# Altium project Phaser.PrjPCB (part 2 of 5)

## Sheet PWR_Supply.SchDoc: Phaser
size 420 x 297 mm; EDA_Number: ARTIQ; Projet: ARTIQ/SINARA; Author: G.Kasprowicz; CompanyName: WUT ISE; DrawnBy: G.Kasprowicz; Organization: WUT ISE; Address1: PW ISE; Address2: Nowowiejska 15/19 00-665 Warsaw; Address3: gkasprow@gmail.com; Revision: 2; SheetNumber: -; SheetTotal: -; ModifiedBy: -; CheckedDate: -; Title2: xxx; DivGrp: WUT ISE; Designer: G.Kasprowicz; ModifiedDate: -; ProjectName: Sensor Box
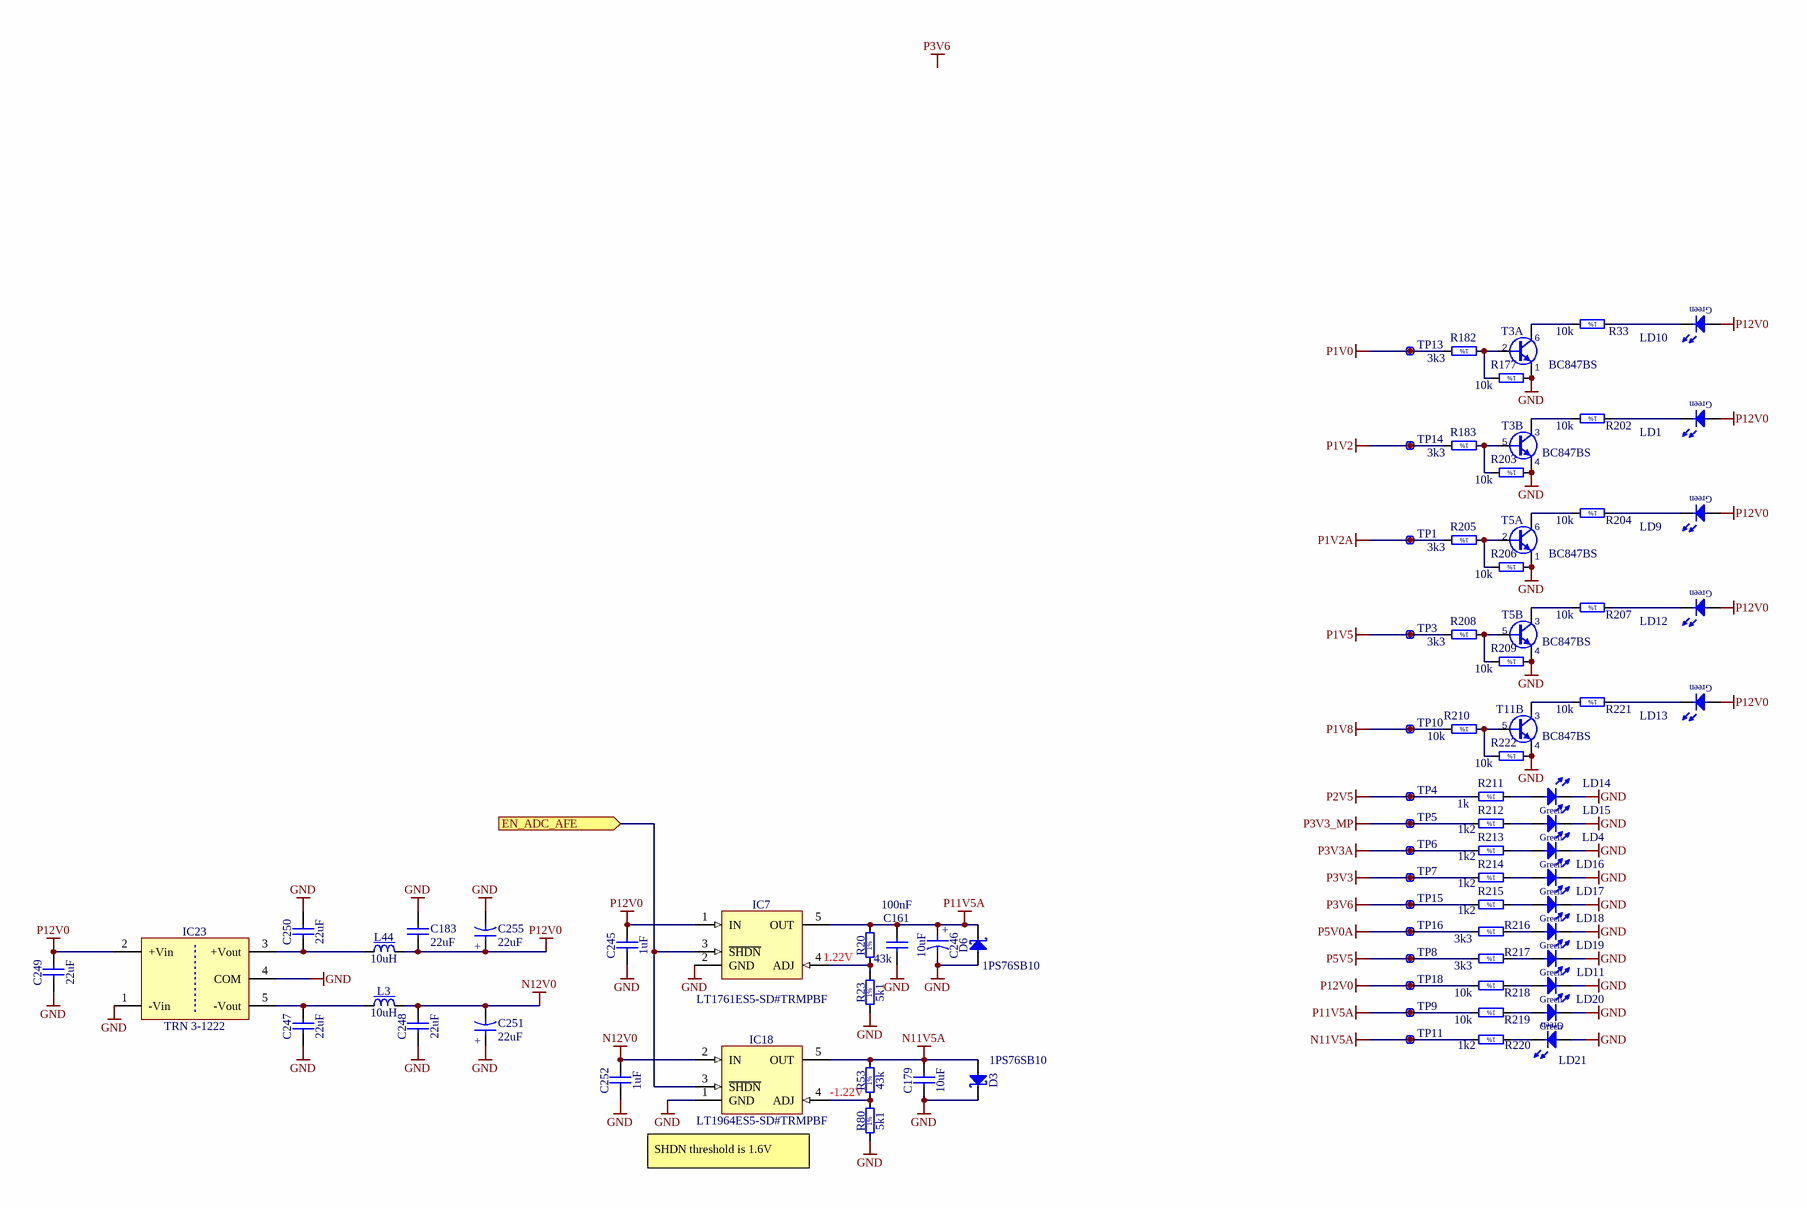
[diagram p3: PWR_Supply.SchDoc]

### Parts
C161  100nF  [CAPC1005X55N]
C179  10uF  [CAPC2012X135N]
C183  22uF  [CAPC2012X135N]
C245  1uF  [CAPC1608X87N]
C246  10uF  [CAPMP3216X180N]
C247  22uF  [CAPC2012X135N]
C248  22uF  [CAPC2012X135N]
C249  22uF  [CAPC2012X135N]
C250  22uF  [CAPC2012X135N]
C251  22uF  [CAPMP3528X210N]
C252  1uF  [CAPC1608X87N]
C255  22uF  [CAPMP3528X210N]
D3  1PS76SB10  [SOD2512X110N]
D6  1PS76SB10  [SOD2512X110N]
IC7  LT1761ES5-SD#TRMPBF  [SOT95P280X100-5N]
IC18  LT1964ES5-SD#TRMPBF  [SOT95P280X100-5N]
IC23  TRN 3-1222  [DCDC_TRACO_TRN3]
L3  10uH  [IND_MURATA-PS_8400]
L44  10uH  [IND_MURATA-PS_8400]
LD1  Green  [LED_KINGBRIGHT_KPH-1608CGCKr]  (value not drawn)
LD4  Green  [LED_KINGBRIGHT_KPH-1608CGCKr]  (value not drawn)
LD9  Green  [LED_KINGBRIGHT_KPH-1608CGCKr]  (value not drawn)
LD10  Green  [LED_KINGBRIGHT_KPH-1608CGCKr]  (value not drawn)
LD11  Green  [LED_KINGBRIGHT_KPH-1608CGCKr]  (value not drawn)
LD12  Green  [LED_KINGBRIGHT_KPH-1608CGCKr]  (value not drawn)
LD13  Green  [LED_KINGBRIGHT_KPH-1608CGCKr]  (value not drawn)
LD14  Green  [LED_KINGBRIGHT_KPH-1608CGCKr]  (value not drawn)
LD15  Green  [LED_KINGBRIGHT_KPH-1608CGCKr]  (value not drawn)
LD16  Green  [LED_KINGBRIGHT_KPH-1608CGCKr]  (value not drawn)
LD17  Green  [LED_KINGBRIGHT_KPH-1608CGCKr]  (value not drawn)
LD18  Green  [LED_KINGBRIGHT_KPH-1608CGCKr]  (value not drawn)
LD19  Green  [LED_KINGBRIGHT_KPH-1608CGCKr]  (value not drawn)
LD20  Green  [LED_KINGBRIGHT_KPH-1608CGCKr]  (value not drawn)
LD21  Green  [LED_KINGBRIGHT_KPH-1608CGCKr]  (value not drawn)
R20  43k  [RESC1005X40N]
R23  5k1  [RESC1005X40N]
R33  10k  [RESC1005X40N]
R53  43k  [RESC1005X40N]
R80  5k1  [RESC1005X40N]
R177  10k  [RESC1005X40N]
R182  3k3  [RESC1608X55N]
R183  3k3  [RESC1608X55N]
R202  10k  [RESC1005X40N]
R203  10k  [RESC1005X40N]
R204  10k  [RESC1005X40N]
R205  3k3  [RESC1608X55N]
R206  10k  [RESC1005X40N]
R207  10k  [RESC1005X40N]
R208  3k3  [RESC1608X55N]
R209  10k  [RESC1005X40N]
R210  10k  [RESC1005X40N]
R211  1k  [RESC1608X55N]
R212  1k2  [RESC1608X55N]
R213  1k2  [RESC1608X55N]
R214  1k2  [RESC1608X55N]
R215  1k2  [RESC1608X55N]
R216  3k3  [RESC1608X55N]
R217  3k3  [RESC1608X55N]
R218  10k  [RESC1005X40N]
R219  10k  [RESC1005X40N]
R220  1k2  [RESC1608X55N]
R221  10k  [RESC1005X40N]
R222  10k  [RESC1005X40N]
T3  BC847BS  [SOT65P210X110-6N]  (parts A,B of 2)
T5  BC847BS  [SOT65P210X110-6N]  (parts A,B of 2)
T11  BC847BS  [SOT65P210X110-6N]  (part B of 2)
TP1  Test Point  [TPS127]  (value not drawn)
TP3  Test Point  [TPS127]  (value not drawn)
TP4  Test Point  [TPS127]  (value not drawn)
TP5  Test Point  [TPS127]  (value not drawn)
TP6  Test Point  [TPS127]  (value not drawn)
TP7  Test Point  [TPS127]  (value not drawn)
TP8  Test Point  [TPS127]  (value not drawn)
TP9  Test Point  [TPS127]  (value not drawn)
TP10  Test Point  [TPS127]  (value not drawn)
TP11  Test Point  [TPS127]  (value not drawn)
TP13  Test Point  [TPS127]  (value not drawn)
TP14  Test Point  [TPS127]  (value not drawn)
TP15  Test Point  [TPS127]  (value not drawn)
TP16  Test Point  [TPS127]  (value not drawn)
TP18  Test Point  [TPS127]  (value not drawn)

### Ports
EN_ADC_AFE (in)

### Nets
GND: C161.1 C179.1 C183.1 C245.1 C246.2 C247.1 C248.1 C249.1 C250.2 C251.1 C252.1 C255.2 D3.1(C) D6.2(A) IC7.2(GND) IC18.1(GND) IC23.1(-Vin) IC23.4(COM) LD4.1(C) LD11.1(C) LD14.1(C) LD15.1(C) LD16.1(C) LD17.1(C) LD18.1(C) LD19.1(C) LD20.1(C) LD21.2(A) R23.1 R80.1 R177.1 R203.1 R206.1 R209.1 R222.1 T3.1(E) T3.4(E) T5.1(E) T5.4(E) T11.4(E)
N11V5A: C179.2 D3.2(A) IC18.5(OUT) R53.2 R220.2 TP11.1
N12V0: C248.2 C251.2 C252.2 IC18.2(IN) L3.2
P1V0: R182.2 TP13.1
P1V2: R183.2 TP14.1
P1V2A: R205.2 TP1.1
P1V5: R208.2 TP3.1
P1V8: R210.2 TP10.1
P2V5: R211.2 TP4.1
P3V3: R214.2 TP7.1
P3V3_MP: R212.2 TP5.1
P3V3A: R213.2 TP6.1
P3V6: R215.2 TP15.1
P5V0A: R216.2 TP16.1
P5V5: R217.2 TP8.1
P11V5A: C161.2 C246.1 D6.1(C) IC7.5(OUT) R20.2 R219.2 TP9.1
P12V0: C183.2 C245.2 C249.2 C255.1 IC7.1(IN) IC23.2(+Vin) L44.2 LD1.2(A) LD9.2(A) LD10.2(A) LD12.2(A) LD13.2(A) R218.2 TP18.1
NetC247_2: C247.2 IC23.5(-Vout) L3.1
NetC250_1: C250.1 IC23.3(+Vout) L44.1
NetIC7_3: IC7.3(~{SHDN}) IC18.3(~{SHDN}) ; port EN_ADC_AFE
NetIC7_4: IC7.4(ADJ) R20.1 R23.2
NetIC18_4: IC18.4(ADJ) R53.1 R80.2
NetLD1_1: LD1.1(C) R202.1
NetLD4_2: LD4.2(A) R213.1
NetLD9_1: LD9.1(C) R204.1
NetLD10_1: LD10.1(C) R33.1
NetLD11_2: LD11.2(A) R218.1
NetLD12_1: LD12.1(C) R207.1
NetLD13_1: LD13.1(C) R221.1
NetLD14_2: LD14.2(A) R211.1
NetLD15_2: LD15.2(A) R212.1
NetLD16_2: LD16.2(A) R214.1
NetLD17_2: LD17.2(A) R215.1
NetLD18_2: LD18.2(A) R216.1
NetLD19_2: LD19.2(A) R217.1
NetLD20_2: LD20.2(A) R219.1
NetLD21_1: LD21.1(C) R220.1
NetR33_2: R33.2 T3.6(C)
NetR177_2: R177.2 R182.1 T3.2(B)
NetR183_1: R183.1 R203.2 T3.5(B)
NetR202_2: R202.2 T3.3(C)
NetR204_2: R204.2 T5.6(C)
NetR205_1: R205.1 R206.2 T5.2(B)
NetR207_2: R207.2 T5.3(C)
NetR208_1: R208.1 R209.2 T5.5(B)
NetR210_1: R210.1 R222.2 T11.5(B)
NetR221_2: R221.2 T11.3(C)

### Notes on the sheet
- 1.22V
- -1.22V
- SHDN threshold is 1.6V
- Labels drawn without touching a wire or pin: P3V6
- Project/Equipment
- Document
- Designer
- Drawn by
- Check.by
- Copyright WUT ISE 2018.
  This documentation describes Open Hardware and is licensed under the CERN OHL v.1.1. You may redistribute and modify this documentation under the terms of the CERN OHL v.1.1. (http://ohwr.org/CERNOHL). This documentation is distributed WITHOUT ANY EXPRESS OR IMPLIED WARRANTY, INCLUDING OF MERCHANTABILITY, SATISFACTORY QUALITY AND FITNESS FOR A PARTICULAR PURPOSE. Please see the CERN OHL v.1.1 for applicable conditions.
- Contact
- File
- Last Mod.
- Print Date
- Sheet
- Size
- A3
- of
- Rev
- (in symbol CTE3216-18_10UF_16V_20%_AVX_TCJ) +
- (in symbol CTE3528-21_22UF_10V_10%_LESR0700) +
- (in symbol R0402_5K1_1%_0.0625W_100PPM) 1%
- (in symbol R0402_10K_1%_0.0625W_100PPM) 1%
- (in symbol R0402_43K_1%_0.0625W_100PPM) 1%
- (in symbol R0603_1K2_1%_0.1W_100PPM) 1%
- (in symbol R0603_1K_1%_0.1W_100PPM) 1%
- (in symbol R0603_3k3_1%_0.1W_100PPM) 1%

### Library data of the parts
C161 = CC0402_100NF_16V_10%_X5R: Non-polarised capacitor; Part Description: SMD Multilayer Chip Ceramic Capacitor; Manufacturer: GENERIC; Manufacturer1 Part Number: GRM155R61C104KA88D; Voltage: 16V; TC: X5R; Tolerance: ±10%; Part Number: CC0402_100NF_16V_10%_X5R; Component Kind: Standard; Component Type: Standard; Pin Count: 2; Value: 100nF; Status: None; Manufacturer Part Number: CC0402_100NF_16V_10%_X5R; Case: 0402; Mounted: Yes; Socket: No; SMD: Yes; Sense: No; Manufacturer1 Example: MURATA; Manufacturer1 ComponentHeight: 0.55mm; HelpURL: \\cern.ch\dfs\Applications\Altium\Datasheets\CC0402_X5R_MURATA_GRM.pdf; Author: CERN DEM JLC; CreateDate: 10.12.2013; LatestRevisionDate: 10.12.2013
C179 = CC0805_10UF_16V_10%_X5R: Non-polarised capacitor; Part Description: SMD Multilayer Chip Ceramic Capacitor; Manufacturer: GENERIC; Manufacturer1 Part Number: C0805C106K4PAC; Voltage: 16V; TC: X5R; Tolerance: ±10%; Part Number: CC0805_10UF_16V_10%_X5R; Component Kind: Standard; Component Type: Standard; Pin Count: 2; Value: 10uF; Status: Preferred; Manufacturer Part Number: CC0805_10UF_16V_10%_X5R; Case: 0805; Mounted: Yes; Socket: No; SMD: Yes; Manufacturer1 Example: KEMET; Manufacturer1 ComponentHeight: 1.4mm; HelpURL: \\cern.ch\dfs\Applications\Altium\Datasheets\CC1206_X5R_KEMET.pdf; Author: CERN DEM JLC; CreateDate: 03.12.2007; LatestRevisionDate: 03.12.2007; Sense: No
C183 C247-C250 = CC0805_22UF_16V_10%_X5R: Non-polarised capacitor; Part Description: SMD Multilayer Chip Ceramic Capacitor; Manufacturer: GENERIC; Manufacturer1 Part Number: C2012X5R1C226KT; Voltage: 16V; TC: X5R; Tolerance: ±10%; Part Number: CC0805_22UF_16V_10%_X5R; Component Kind: Standard; Component Type: Standard; Pin Count: 2; Value: 22uF; Status: Preferred; Manufacturer Part Number: CC0805_22UF_16V_10%_X5R; Case: 0805; Mounted: Yes; Socket: No; SMD: Yes; Sense: No; Manufacturer1 Example: TDK; Manufacturer1 ComponentHeight: 1.35mm; HelpURL: \\cern.ch\dfs\Applications\Altium\Datasheets\CC0805_X5R_TDK_C.pdf; Author: CERN DEM JLC; CreateDate: 25.10.2012; LatestRevisionDate: 25.10.2012
C245 C252 = CC0603_1UF_25V_10%_X7R: Non-polarised capacitor; Part Description: SMD Multilayer Chip Ceramic Capacitor; Manufacturer: GENERIC; Manufacturer1 Part Number: GRM188R71E105KA12D; Voltage: 25V; TC: X7R; Tolerance: ±10%; Part Number: CC0603_1UF_25V_10%_X7R; Component Kind: Standard; Component Type: Standard; Pin Count: 2; Value: 1uF; Status: None; Manufacturer Part Number: CC0603_1UF_25V_10%_X7R; Case: 0603; Mounted: Yes; Socket: No; SMD: Yes; Sense: No; Manufacturer1 Example: MURATA; Manufacturer1 ComponentHeight: 0.9mm; HelpURL: \\cern.ch\dfs\Applications\Altium\Datasheets\CC0603_X7R_MURATA.pdf; Author: CERN DEM JLC; CreateDate: 18.01.2011; LatestRevisionDate: 18.01.2011
C246 = CTE3216-18_10UF_16V_20%_AVX_TCJ: Polarised capacitor; Part Description: ESR 0R200 Tantalum Solid Electrolytic Chip Capacitor with Conductive Polymer Electrode; Manufacturer: AVX; Manufacturer Part Number: TCJA106M016R0200; Voltage: 16V; Tolerance: ±20%; Part Number: CTE3216-18_10UF_16V_20%_AVX_TCJ; Component Kind: Standard; Component Type: Standard; Pin Count: 2; Value: 10uF; Status: Preferred; Case: A; Mounted: Yes; Socket: No; SMD: Yes; Sense: No; ComponentHeight: 1.8mm; HelpURL: \\cern.ch\dfs\Applications\Altium\Datasheets\CTE_AVX_TCJ.pdf; Author: CERN DEM JLC; CreateDate: 29.03.2012; LatestRevisionDate: 29.03.2012
C251 C255 = CTE3528-21_22UF_10V_10%_LESR0700: Polarised capacitor; Part Description: Low ESR 0R7 Solid Tantalum Chip Capacitor; Manufacturer: GENERIC; Manufacturer1 Part Number: TPSB226K010R0700; Voltage: 10V; Tolerance: ±10%; Part Number: CTE3528-21_22UF_10V_10%_LESR0700; Component Kind: Standard; Component Type: Standard; Pin Count: 2; Value: 22uF; Status: Preferred; Manufacturer Part Number: CTE3528-21_22UF_10V_10%_LESR0700; Case: B; Mounted: Yes; Socket: No; SMD: Yes; Sense: No; Manufacturer1 Example: AVX; Manufacturer1 ComponentHeight: 2.1mm; HelpURL: \\cern.ch\dfs\Applications\Altium\Datasheets\CTE-LESR_AVX_TPS.pdf; Author: CERN DEM JLC; CreateDate: 05.05.2008; LatestRevisionDate: 20.01.2009
D3 D6 = 1PS76SB10: Schottky Diode; Part Description: Schottky Barrier Single Diode; Manufacturer: NXP SEMICONDUCTORS; Voltage: 30V; Power: 200mA; PressFit: No; Bonding: No; Part Number: 1PS76SB10; Component Kind: Standard; Component Type: Standard; Device: 1PS76SB10; PackageDescription: Small Outline Diode Flat Lead (SOD-323), 1.70mm W X 1.25mm L X 1.10mm H body,  IPC Medium Density; Manufacturer Part Number: 1PS76SB10; Pin Count: 2; Case: SOD323; Mounted: Yes; Socket: No; SMD: Yes; Sense: No; ComponentHeight: 1.1mm; HelpURL: \\cern.ch\dfs\Applications\Altium\Datasheets\1PS76SB10.pdf; Author: CERN DEM JLC; CreateDate: 2012-12-06; LatestRevisionDate: 2012-12-06
IC7 = LT1761ES5-SD#TRMPBF: 100mA, Low Noise, LDO Micropower Adjustable Regulator in SOT-23; Part Description: 1.22V to 20V, 100mA, Low Noise, LDO Adjustable Micropower Regulator; Manufacturer: LINEAR TECHNOLOGY; PressFit: No; Bonding: No; Part Number: LT1761ES5-SD#TRMPBF; Component Kind: Standard; Component Type: Standard; Device: LT1761ES5-SD#TRMPBF; PackageDescription: SOT23, 0.95mm pitch; 5 pin, 1.6mm W X 2.9mm L, IPC Medium Density; Manufacturer Part Number: LT1761ES5-SD#TRMPBF; Pin Count: 5; Case: SOT23; Mounted: Yes; Socket: No; SMD: Yes; Sense: No; ComponentHeight: 1mm; HelpURL: \\cern.ch\dfs\Applications\Altium\Datasheets\LT1761ES5-SD#TRMPBF.pdf; Author: CERN DEM JLC; CreateDate: 26.08.2013; LatestRevisionDate: 26.08.2013
IC18 = LT1964ES5-SD#TRMPBF: 200mA, Low Noise, Low Dropout Negative Micropower Regulator; Part Description: -1.22V to -20V, 200mA, Low Noise, Low Dropout Negative Micropower Regulator; Manufacturer: LINEAR TECHNOLOGY; PressFit: No; Bonding: No; Part Number: LT1964ES5-SD#TRMPBF; Component Kind: Standard; Component Type: Standard; Device: LT1964ES5-SD#TRMPBF; PackageDescription: SOT23, 0.95mm pitch; 5 pin, 1.75mm W X 3.00mm L, IPC Medium Density; Manufacturer Part Number: LT1964ES5-SD#TRMPBF; Pin Count: 5; Case: SOT23-5; Mounted: Yes; Socket: No; SMD: Yes; Sense: No; ComponentHeight: 1mm; HelpURL: \\cern.ch\dfs\Applications\Altium\Datasheets\LT1964ES5-SD#TRMPBF.pdf; Author: CERN DEM JLC; CreateDate: 05.05.2009; LatestRevisionDate: 05.05.2009
IC23 = TRN 3-1222: TRACO, TRN 3 Serie, Dual Output DCDC Converter; Part Description: 9-18VDC to ±12V, Iout (max) ±125mA, 3W DC-DC Converter; Manufacturer: TRACO POWER; PressFit: No; Bonding: No; Part Number: TRN 3-1222; Component Kind: Standard; Component Type: Standard; Device: TRN 3-1222; PackageDescription: TRN 3 Series , Body 11.9 x 7.7mm; Manufacturer Part Number: TRN 3-1222; Pin Count: 5; Mounted: Yes; Socket: No; SMD: No; Sense: No; ComponentHeight: 11.5mm; HelpURL: \\cern.ch\dfs\Applications\Altium\Datasheets\TRN 3-1222.pdf; Author: CERN DEM JLC; CreateDate: 06.06.2017; LatestRevisionDate: 06.06.2017
L3 L44 = IND_10UH_10%_MURATA-PS_8400: Inductor With Core; Part Description: Miniature Surface Mount Power Inductor (8400 Serie); Manufacturer: MURATA POWER SOLUTIONS; Manufacturer Part Number: 84103C; Power: 950mA; Resistance: 0.24R; Tolerance: ±10%; Part Number: IND_10UH_10%_MURATA-PS_8400; Component Kind: Standard; Component Type: Standard; Pin Count: 2; Value: 10uH; Status: None; Mounted: Yes; Socket: No; SMD: Yes; Sense: No; ComponentHeight: 2.9mm; HelpURL: \\cern.ch\dfs\Applications\Altium\Datasheets\IND_MURATA-PS_8400.pdf; Author: CERN DEM JLC; CreateDate: 02.07.2012; LatestRevisionDate: 02.07.2012
LD1 LD4 LD9-LD21 = LED_0603_Green: Green 0603; Part Number: LED_KINGBRIGHT_KPH-1608CGCK; Part Description: SMD Green LED, Case 1.6mmX0.8mm(0603), 0.65mm Thickness; Manufacturer: KINGBRIGHT; Manufacturer Part Number: KPH-1608CGCK; PressFit: No; Bonding: No; Component Kind: Standard; Component Type: Standard; Color: Green; Footprint: LED_KINGBRIGHT_KPH-1608CGCK; PackageDescription: SMT Green LED, Case 0603, Body L 1.6 x W 0.8mm H 0.65mm; Pin Count: 2; Mounted: Yes; Socket: No; SMD: Yes; Sense: No; ComponentHeight: 0.65mm; HelpURL: \\cern.ch\dfs\Applications\Altium\Datasheets\LED_KINGBRIGHT_KPH-1608CGCK.pdf; Author: CERN DEM JLC; CreateDate: 03.07.2017; LatestRevisionDate: 03.07.2017
R20 R53 = R0402_43K_1%_0.0625W_100PPM: Resistor - 1%; Part Description: General Purpose Thick Film Chip Resistor; Manufacturer: GENERIC; Manufacturer1 Part Number: 232270674303L; TC: ±100ppm/°C; PressFit: No; Part Number: R0402_43K_1%_0.0625W_100PPM; Component Kind: Standard; Component Type: Standard; Pin Count: 2; Value: 43k; Status: Not Recommended; Power: 0.0625W; Tolerance: ±1%; Manufacturer Part Number: R0402_43K_1%_0.0625W_100PPM; Case: 0402; Mounted: Yes; Sense: No; Socket: No; SMD: Yes; Manufacturer1 Example: YAGEO PHYCOMP; Manufacturer1 ComponentHeight: 0.4mm; HelpURL: \\cern.ch\dfs\Applications\Altium\Datasheets\R0402_Phycomp_RC0402.pdf; Author: CERN DEM JLC; CreateDate: 03.12.2007; LatestRevisionDate: 17.10.2012
R23 R80 = R0402_5K1_1%_0.0625W_100PPM: Resistor - 1%; Part Description: General Purpose Thick Film Chip Resistor; Manufacturer: GENERIC; Manufacturer1 Part Number: 232270675102L; TC: ±100ppm/°C; PressFit: No; Part Number: R0402_5K1_1%_0.0625W_100PPM; Component Kind: Standard; Component Type: Standard; Pin Count: 2; Value: 5k1; Status: Not Recommended; Power: 0.0625W; Tolerance: ±1%; Manufacturer Part Number: R0402_5K1_1%_0.0625W_100PPM; Case: 0402; Mounted: Yes; Sense: No; Socket: No; SMD: Yes; Manufacturer1 Example: YAGEO PHYCOMP; Manufacturer1 ComponentHeight: 0.4mm; HelpURL: \\cern.ch\dfs\Applications\Altium\Datasheets\R0402_Phycomp_RC0402.pdf; Author: CERN DEM JLC; CreateDate: 03.12.2007; LatestRevisionDate: 17.10.2012
R33 R177 R202-R204 R206 R207 R209 R210 R218 R219 R221 R222 = R0402_10K_1%_0.0625W_100PPM: Resistor - 1%; Part Description: General Purpose Thick Film Chip Resistor; Manufacturer: GENERIC; Manufacturer1 Part Number: 232270671003L; TC: ±100ppm/°C; Part Number: R0402_10K_1%_0.0625W_100PPM; Component Kind: Standard; Component Type: Standard; Pin Count: 2; Value: 10k; Status: Not recommended; Power: 0.0625W; Tolerance: ±1%; Manufacturer Part Number: R0402_10K_1%_0.0625W_100PPM; Case: 0402; Mounted: Yes; Sense: No; Socket: No; SMD: Yes; Manufacturer1 Example: YAGEO PHYCOMP; Manufacturer1 ComponentHeight: 0.4mm; HelpURL: \\cern.ch\dfs\Applications\Altium\Datasheets\R0402_Phycomp_RC0402.pdf; Author: CERN DEM JLC; CreateDate: 03.12.2007; LatestRevisionDate: 17.10.2012
R182 R183 R205 R208 R216 R217 = R0603_3k3_1%_0.1W_100PPM: Resistor - 1%; Part Description: General Purpose Thick Film Chip Resistor; Manufacturer: GENERIC; Manufacturer1 Part Number: NRC06F3301TRF; Power: 0.1W; TC: ±100ppm/°C; PressFit: No; Part Number: R0603_3K3_1%_0.1W_100PPM; Component Kind: Standard; Component Type: Standard; Pin Count: 2; Value: 3k3; Status: Preferred; Tolerance: ±1%; Manufacturer Part Number: R0603_3K3_1%_0.1W_100PPM; Case: 0603; Mounted: Yes; Sense: No; Socket: No; SMD: Yes; Manufacturer1 Example: NIC COMPONENT; Manufacturer1 ComponentHeight: 0.55mm; HelpURL: \\cern.ch\dfs\Applications\Altium\Datasheets\R0603_NIC_NRC.pdf; Author: CERN DEM JLC; CreateDate: 03.12.2007; LatestRevisionDate: 13.03.2008
R211 = R0603_1K_1%_0.1W_100PPM: Resistor - 1%; Part Description: General Purpose Thick Film Chip Resistor; Manufacturer: GENERIC; Manufacturer1 Part Number: NRC06F1001TRF; Power: 0.1W; TC: ±100ppm/°C; PressFit: No; Part Number: R0603_1K_1%_0.1W_100PPM; Component Kind: Standard; Component Type: Standard; Pin Count: 2; Value: 1k; Status: Preferred; Tolerance: ±1%; Manufacturer Part Number: R0603_1K_1%_0.1W_100PPM; Case: 0603; Mounted: Yes; Sense: No; Socket: No; SMD: Yes; Manufacturer1 Example: NIC COMPONENT; Manufacturer1 ComponentHeight: 0.55mm; HelpURL: \\cern.ch\dfs\Applications\Altium\Datasheets\R0603_NIC_NRC.pdf; Author: CERN DEM JLC; CreateDate: 03.12.2007; LatestRevisionDate: 13.03.2008
R212-R215 R220 = R0603_1K2_1%_0.1W_100PPM: Resistor - 1%; Part Description: General Purpose Thick Film Chip Resistor; Manufacturer: GENERIC; Manufacturer1 Part Number: NRC06F1201TRF; Power: 0.1W; TC: ±100ppm/°C; Part Number: R0603_1K2_1%_0.1W_100PPM; Component Kind: Standard; Component Type: Standard; Pin Count: 2; Value: 1k2; Status: Preferred; Tolerance: ±1%; Manufacturer Part Number: R0603_1K2_1%_0.1W_100PPM; Case: 0603; Mounted: Yes; Sense: No; Socket: No; SMD: Yes; Manufacturer1 Example: NIC COMPONENT; Manufacturer1 ComponentHeight: 0.55mm; HelpURL: \\cern.ch\dfs\Applications\Altium\Datasheets\R0603_NIC_NRC.pdf; Author: CERN DEM JLC; CreateDate: 03.12.2007; LatestRevisionDate: 13.03.2008
T3 T5 T11 = BC847BS: 45V 100mA Dual NPN General-Purpose Transistor; Manufacturer: NXP SEMICONDUCTORS; PressFit: No; Bonding: No; Part Number: BC847BS; Component Kind: Standard; Component Type: Standard; Device: BC847BS; PackageDescription: SOT363, SC-88, SOT, 0.65mm Pitch, 6 pin, 1.25mm W X 2.00mm L X 1.10mm H, IPC Medium Density; Part Description: 45V 100mA Dual NPN General-Purpose Transistor; Manufacturer Part Number: BC847BS; Pin Count: 6; Case: SOT363; Mounted: Yes; Socket: No; SMD: Yes; Sense: No; ComponentHeight: 1.1mm; HelpURL: \\cern.ch\dfs\Applications\Altium\Datasheets\BC847BS.pdf; Author: CERN DEM JMW; CreateDate: 10.07.2015; LatestRevisionDate: 10.07.2015
TP1 TP3-TP11 TP13-TP16 TP18 = SMD_PAD_1.27X1.27MM: Part Description: 1.27mm x 1.27mm PCB Copper Area (SMD Test Point); Mounted: No; Part Number: SMD_PAD_1.27X1.27MM; Component Kind: Standard (No BOM); Component Type: Standard (No BOM); Pin Count: 1; Family: Test Point; Socket: No; SMD: Yes; Sense: No; Status: None; ComponentHeight: 0mm; HelpURL: Undefined; Author: CERN DEM JLC; CreateDate: 12.01.2008; LatestRevisionDate: 12.01.2008; PackageDescription: 1.27mm x 1.27mm PCB Copper Area (SMD Test Point)

## Sheet ADC_2CH.SchDoc: Phaser
size 420 x 297 mm; EDA_Number: Sinara; Projet: BaseMod; Author: G.Kasprowicz; CompanyName: WUT ISE; DrawnBy: G.Kasprowicz; Organization: WUT ISE; Address1: PW ISE; Address2: Nowowiejska 15/19 00-665 Warsaw; Address3: gkasprow@gmail.com; Revision: 2; SheetNumber: -; SheetTotal: -; ModifiedBy: -; CheckedDate: -; Title2: xxx; DivGrp: WUT ISE; Designer: G.Kasprowicz; ModifiedDate: -; ProjectName: Sensor Box
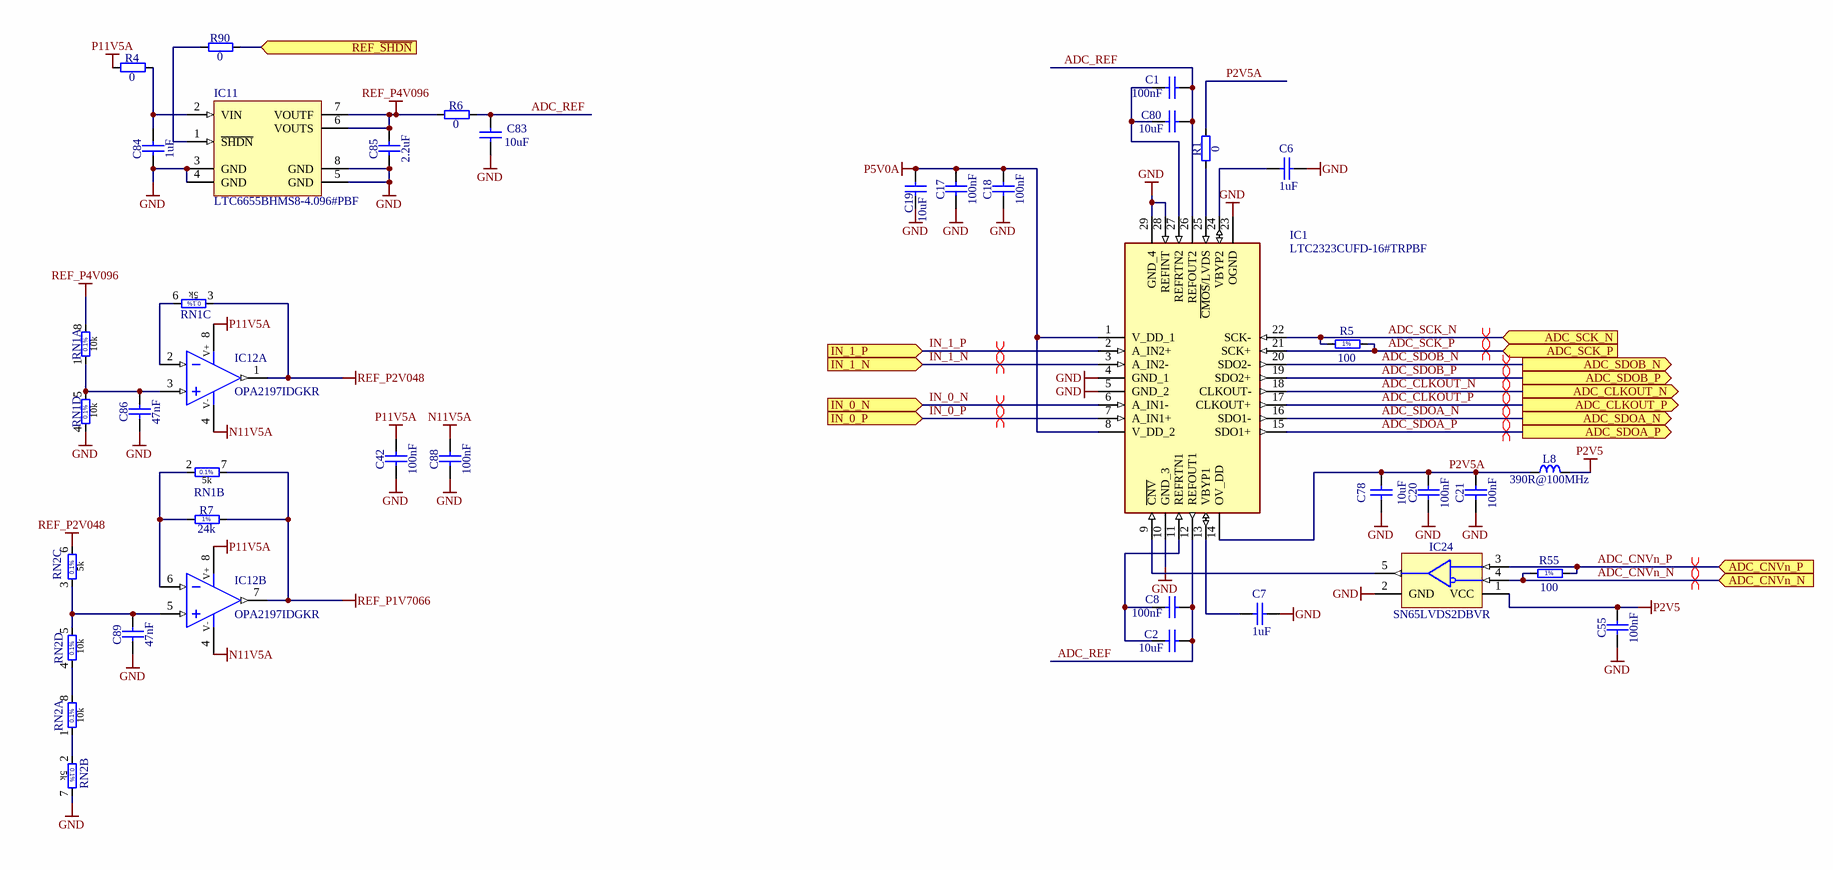
[diagram p4: ADC_2CH.SchDoc]

### Parts
C1  100nF  [CAPC1608X87N]
C2  10uF  [CAPC2012X95N]
C6  1uF  [CAPC1608X87N]
C7  1uF  [CAPC1608X87N]
C8  100nF  [CAPC1608X87N]
C17  100nF  [CAPC1608X87N]
C18  100nF  [CAPC1608X87N]
C19  10uF  [CAPC2012X95N]
C20  100nF  [CAPC1608X87N]
C21  100nF  [CAPC1608X87N]
C42  100nF  [CAPC1005X55N]
C55  100nF  [CAPC1608X87N]
C78  10uF  [CAPC2012X95N]
C80  10uF  [CAPC2012X95N]
C83  10uF  [CAPC2012X95N]
C84  1uF  [CAPC1608X87N]
C85  2.2uF  [CAPC1608X87N]
C86  47nF  [CAPC2012X135N]
C88  100nF  [CAPC1005X55N]
C89  47nF  [CAPC2012X135N]
IC1  LTC2323CUFD-16#TRPBF  [QFN50P400X500X80-29N]
IC11  LTC6655BHMS8-4.096#PBF  [SOP65P490X110-8N]
IC12  OPA2197IDGKR  [SOP65P490X110-8N]  (parts A,B of 2)
IC24  SN65LVDS2DBVR  [SOT95P280X145-5N]
L8  390R@100MHz  [INDC1608X95N]
R1  0  [RESC1005X40N]
R4  0  [RESC1005X40N]
R5  100  [RESC1005X40N]
R6  0  [RESC1005X40N]
R7  24k  [RESC1608X55N]
R55  100  [RESC1005X40N]
R90  0  [RESC1005X40N]
RN1  10k 5K 5K 10K  [SOIC127P600X175-8N]  (value not drawn)  (parts A,B,C,D of 4)
RN2  10k 5K 5K 10K  [SOIC127P600X175-8N]  (value not drawn)  (parts A,B,C,D of 4)

### Ports
ADC_CLKOUT_N (out), ADC_CLKOUT_P (out), ADC_CNVn_N (in), ADC_CNVn_P (in), ADC_SCK_N (in), ADC_SCK_P (in), ADC_SDOA_N (out), ADC_SDOA_P (out), ADC_SDOB_N (out), ADC_SDOB_P (out), IN_0_N (in), IN_0_P (in), IN_1_N (in), IN_1_P (in), REF_~{SHDN} (in)

### Nets
GND: C6.1 C7.1 C17.1 C18.1 C19.1 C20.1 C21.1 C42.1 C55.1 C78.1 C83.1 C84.1 C85.1 C86.1 C88.1 C89.1 IC1.4(GND_1) IC1.5(GND_2) IC1.10(GND_3) IC1.23(OGND) IC1.28(REFINT) IC1.29(GND_4) IC11.3(GND) IC11.4(GND) IC11.5(GND) IC11.8(GND) IC24.2(GND) RN1.4 RN2.7
N11V5A: C88.2 IC12.4(V-)
P2V5: C55.2 IC24.1(VCC) L8.2
P5V0A: C17.2 C18.2 C19.2 IC1.1(V_DD_1) IC1.8(V_DD_2)
P11V5A: C42.2 IC12.8(V+) R4.1
REF_P1V7066: IC12.7(OUT) R7.2 RN1.7
REF_P2V048: IC12.1(OUT) RN1.3 RN2.6
REF_P4V096: C85.2 IC11.6(VOUTS) IC11.7(VOUTF) R6.1 RN1.8
ADC_CLKOUT_N: IC1.18(CLKOUT-) ; port ADC_CLKOUT_N
ADC_CLKOUT_P: IC1.17(CLKOUT+) ; port ADC_CLKOUT_P
ADC_CNVn_N: IC24.4(B) R55.1 ; port ADC_CNVn_N
ADC_CNVn_P: IC24.3(A) R55.2 ; port ADC_CNVn_P
ADC_REF: C1.1 C2.2 C8.1 C80.2 C83.2 IC1.12(REFOUT1) IC1.26(REFOUT2) R6.2
ADC_SCK_N: IC1.22(SCK-) R5.1 ; port ADC_SCK_N
ADC_SCK_P: IC1.21(SCK+) R5.2 ; port ADC_SCK_P
ADC_SDOA_N: IC1.16(SDO1-) ; port ADC_SDOA_N
ADC_SDOA_P: IC1.15(SDO1+) ; port ADC_SDOA_P
ADC_SDOB_N: IC1.20(SDO2-) ; port ADC_SDOB_N
ADC_SDOB_P: IC1.19(SDO2+) ; port ADC_SDOB_P
IN_0_N: IC1.6(A_IN1-) ; port IN_0_N
IN_0_P: IC1.7(A_IN1+) ; port IN_0_P
IN_1_N: IC1.3(A_IN2-) ; port IN_1_N
IN_1_P: IC1.2(A_IN2+) ; port IN_1_P
P2V5A: C20.2 C21.2 C78.2 IC1.14(OV_DD) L8.1 R1.2
NetC1_2: C1.2 C80.1 IC1.27(REFRTN2)
NetC2_1: C2.1 C8.2 IC1.11(REFRTN1)
NetC6_2: C6.2 IC1.24(VBYP2)
NetC7_2: C7.2 IC1.13(VBYP1)
NetC84_2: C84.2 IC11.2(VIN) R4.2
NetC86_2: C86.2 IC12.3(IN+) RN1.1 RN1.5
NetC89_2: C89.2 IC12.5(IN+) RN2.3 RN2.5
NetIC1_9: IC1.9(~{CNV}) IC24.5(R)
NetIC1_25: IC1.25(~{CMOS}/LVDS) R1.1
NetIC11_1: IC11.1(~{SHDN}) R90.1
NetIC12_2: IC12.2(IN-) RN1.6
NetIC12_6: IC12.6(IN-) R7.1 RN1.2
NetR90_2: R90.2 ; port REF_~{SHDN}
NetRN2_1: RN2.1 RN2.2
NetRN2_4: RN2.4 RN2.8

### Layout directives
differential pair: ADC_CLKOUT_N, ADC_CLKOUT_P, ADC_CNVn_N, ADC_CNVn_P, ADC_SCK_N, ADC_SCK_P, ADC_SDOA_N, ADC_SDOA_P, ADC_SDOB_N, ADC_SDOB_P, IN_0_N, IN_0_P, IN_1_N, IN_1_P

### Notes on the sheet
- Project/Equipment
- Document
- Designer
- Drawn by
- Check.by
- Copyright WUT ISE 2018.
  This documentation describes Open Hardware and is licensed under the CERN OHL v.1.1. You may redistribute and modify this documentation under the terms of the CERN OHL v.1.1. (http://ohwr.org/CERNOHL). This documentation is distributed WITHOUT ANY EXPRESS OR IMPLIED WARRANTY, INCLUDING OF MERCHANTABILITY, SATISFACTORY QUALITY AND FITNESS FOR A PARTICULAR PURPOSE. Please see the CERN OHL v.1.1 for applicable conditions.
- Contact
- File
- Last Mod.
- Print Date
- Sheet
- Size
- A3
- of
- Rev
- (in symbol R0402_100R_1%_0.1W_100PPM) 1%
- (in symbol R0603_24K_1%_0.1W_100PPM) 1%
- (in symbol RN_10K_5K_VISHAY_AORN2-1AT3, part A) 10k
- (in symbol RN_10K_5K_VISHAY_AORN2-1AT3, part B) 5k
- (in symbol RN_10K_5K_VISHAY_AORN2-1AT3, part C) 5k
- (in symbol RN_10K_5K_VISHAY_AORN2-1AT3, part D) 10k

### Library data of the parts
C1 C8 C17 C18 C20 C21 C55 = CC0603_100NF_50V_10%_X7R: Non-polarised capacitor; Part Description: SMD Multilayer Chip Ceramic Capacitor; Manufacturer: GENERIC; Manufacturer1 Part Number: 223858615649; Voltage: 50V; TC: X7R; Tolerance: ±10%; Part Number: CC0603_100NF_50V_10%_X7R; Component Kind: Standard; Component Type: Standard; Pin Count: 2; Value: 100nF; Status: Preferred; Manufacturer Part Number: CC0603_100NF_50V_10%_X7R; Case: 0603; Mounted: Yes; Socket: No; SMD: Yes; Sense: No; Manufacturer1 Example: PHYCOMP; Manufacturer1 ComponentHeight: 0.87mm; HelpURL: \\cern.ch\dfs\Applications\Altium\Datasheets\CC0603_X7R_PHYCOMP.pdf; Author: CERN DEM JLC; CreateDate: 03.12.2007; LatestRevisionDate: 03.12.2007
C2 C19 C78 C80 C83 = CC0805_10UF_25V_10%_X5R: Non-polarised capacitor; Part Description: SMD Multilayer Chip Ceramic Capacitor; Manufacturer: GENERIC; Manufacturer1 Part Number: GRM219R61E106KA12D; Voltage: 25V; TC: X5R; Tolerance: ±10%; Part Number: CC0805_10UF_25V_10%_X5R; Component Kind: Standard; Component Type: Standard; Pin Count: 2; Value: 10uF; Status: Preferred; Manufacturer Part Number: CC0805_10UF_25V_10%_X5R; Case: 0805; Mounted: Yes; Socket: No; SMD: Yes; Sense: No; Manufacturer1 Example: MURATA; Manufacturer1 ComponentHeight: 0.95mm; HelpURL: \\cern.ch\dfs\Applications\Altium\Datasheets\CC0805_X5R_MURATA_GRM.pdf; Author: CERN DEM JLC; CreateDate: 25.10.2012; LatestRevisionDate: 06.09.2016
C6 C7 C84 = CC0603_1UF_25V_10%_X7R: as C245 on sheet PWR_Supply; Part Number: CC0603_1UF_25V_10%_X7R; Component Kind: Standard; Component Type: Standard; Pin Count: 2; Value: 1uF; Status: None; Manufacturer Part Number: CC0603_1UF_25V_10%_X7R; Case: 0603; Mounted: Yes; Socket: No; SMD: Yes; Sense: No; Manufacturer1 Example: MURATA; Manufacturer1 ComponentHeight: 0.9mm; HelpURL: \\cern.ch\dfs\Applications\Altium\Datasheets\CC0603_X7R_MURATA.pdf; Author: CERN DEM JLC; CreateDate: 18.01.2011; LatestRevisionDate: 18.01.2011
C42 C88 = CC0402_100NF_16V_10%_X5R: as C161 on sheet PWR_Supply; Part Number: CC0402_100NF_16V_10%_X5R; Component Kind: Standard; Component Type: Standard; Pin Count: 2; Value: 100nF; Status: None; Manufacturer Part Number: CC0402_100NF_16V_10%_X5R; Case: 0402; Mounted: Yes; Socket: No; SMD: Yes; Sense: No; Manufacturer1 Example: MURATA; Manufacturer1 ComponentHeight: 0.55mm; HelpURL: \\cern.ch\dfs\Applications\Altium\Datasheets\CC0402_X5R_MURATA_GRM.pdf; Author: CERN DEM JLC; CreateDate: 10.12.2013; LatestRevisionDate: 10.12.2013
C85 = CC0603_2.2UF_16V_10%_X5R: Non-polarised capacitor; Part Description: SMD Multilayer Chip Ceramic Capacitor; Manufacturer: GENERIC; Manufacturer1 Part Number: CC0603KRX5R7BB225; Voltage: 16V; TC: X5R; Tolerance: ±10%; Part Number: CC0603_2.2UF_16V_10%_X5R; Component Kind: Standard; Component Type: Standard; Pin Count: 2; Value: 2.2uF; Status: Preferred; Manufacturer Part Number: CC0603_2.2UF_16V_10%_X5R; Case: 0603; Mounted: Yes; Socket: No; SMD: Yes; Sense: No; Manufacturer1 Example: YAGEO; Manufacturer1 ComponentHeight: 0.9mm; HelpURL: \\cern.ch\dfs\Applications\Altium\Datasheets\CC0805_X5R_PHYCOMP_HC.pdf; Author: CERN DEM JLC; CreateDate: 28.04.2011; LatestRevisionDate: 28.04.2011
C86 C89 = CC0805_47NF_25V_5%_C0G: Non-polarised capacitor; Part Description: SMD Multilayer Chip Ceramic Capacitor; Manufacturer: GENERIC; Manufacturer1 Part Number: C0805C473J3GACTU; Voltage: 25V; TC: C0G/NP0; Tolerance: ±5%; Part Number: CC0805_47NF_25V_5%_C0G; Component Kind: Standard; Component Type: Standard; Pin Count: 2; Value: 47nF; Status: None; Manufacturer Part Number: CC0805_47NF_25V_5%_C0G; Case: 0805; Mounted: Yes; Socket: No; SMD: Yes; Sense: No; Manufacturer1 Example: KEMET; Manufacturer1 ComponentHeight: 1.4mm; HelpURL: \\cern.ch\dfs\Applications\Altium\Datasheets\CC0805_C0G_KEMET_(Commercial Grade).pdf; Author: CERN DEM JLC; CreateDate: 18.01.2011; LatestRevisionDate: 18.01.2011
IC1 = LTC2323CUFD-16#TRPBF: Integrated Circuit; Manufacturer_Name: Linear Technology; Datasheet Link: http://www.linear.com/docs/44426; Height: 0.8mm; Manufacturer_Part_Number: LTC2323CUFD-16#TRPBF
IC11 = REF_LTC6655: 0.25ppm Noise, Low Drift Precision Buffered Voltage Reference; Part Description: 4.096V, 0.25ppm Noise, Low Drift Precision Buffered Voltage Reference; Manufacturer: LINEAR TECHNOLOGY; PressFit: No; Bonding: No; Part Number: LTC6655BHMS8-4.096#PBF; Component Kind: Standard; Component Type: Standard; Device: LTC6655BHMS8-4.096#PBF; PackageDescription: SOP, 8-Leads, Body 3.1x3.1mm (max), Pitch 0.65mm, IPC Medium Density; Manufacturer Part Number: LTC6655BHMS8-4.096#PBF; Pin Count: 8; Case: SSOP8; Mounted: Yes; Socket: No; SMD: Yes; Sense: No; ComponentHeight: 1.1mm; HelpURL: \\cern.ch\dfs\Applications\Altium\Datasheets\LTC6655BHMS8-5#PBF.pdf; Author: GK; CreateDate: 07.06.2012; LatestRevisionDate: 07.06.2012
IC12 = OA_OPA2197IDGKR: 36-V, Precision, Rail-to-Rail Input Output, Low Offset Voltage Op Amp 8-VSSOP; Part Description: High-Precision, Low-Noise, Rail-to-Rail Output,10-MHz Op Amp; Manufacturer: TEXAS INSTRUMENTS; PressFit: No; Bonding: No; Part Number: OPA2197IDGKR; Component Kind: Standard; Component Type: Standard; Device: OPA2197IDGKR; PackageDescription: SOP, 0.65mm pitch; 8 pin, 3.00mm W X 3.00mm L X 1.10mm H body, IPC Medium Density; Manufacturer Part Number: OPA2197IDGKR; Pin Count: 8; Case: MSOP8; Mounted: Yes; Socket: No; SMD: Yes; Sense: No; ComponentHeight: 1.1mm; Author: GK; HelpURL: \\cern.ch\dfs\Applications\Altium\Datasheets\OPA2140AIDGK.pdf; CreateDate: 20.04.2017; LatestRevisionDate: 20.04.2017
IC24 = SN65LVDS2DBVR: High-Speed Differential Line Receiver; Manufacturer: TEXAS INSTRUMENTS; PressFit: No; Bonding: No; Part Number: SN65LVDS2DBVR; Component Kind: Standard; Component Type: Standard; Device: SN65LVDS2DBVR; PackageDescription: SOT, 0.95mm pitch; 5 pin, 1.60mm W X 2.90mm L X 1.45mm H body, IPC Medium Density; Part Description: High-Speed Differential Line Receiver; Manufacturer Part Number: SN65LVDS2DBVR; Pin Count: 5; Case: SOT23-5; Mounted: Yes; Socket: No; SMD: Yes; Sense: No; ComponentHeight: 1.45mm; Author: CERN DEM JLC; HelpURL: \\cern.ch\dfs\Applications\Altium\Datasheets\SN65LVDS2DBVR.pdf; CreateDate: 03.03.2011; LatestRevisionDate: 22.09.2011
L8 = IND0603_TDK_MPZ1608R391A: Inductor; Part Description: SMT Chip Bead for Power Line; Manufacturer: TDK; Power: 1.2A; Resistance: 0.12R; Tolerance: ±25%; Part Number: IND0603_TDK_MPZ1608R391A; Component Kind: Standard; Component Type: Standard; Pin Count: 2; Value: 390R@100MHz; Status: None; Manufacturer Part Number: MPZ1608R391A; Case: 0603; Mounted: Yes; Socket: No; SMD: Yes; Sense: No; ComponentHeight: 0.95mm; HelpURL: \\cern.ch\dfs\Applications\Altium\Datasheets\IND0603_TDK_MPZ1608.pdf; Author: CERN DEM JLC; CreateDate: 2009-12-02; LatestRevisionDate: 2009-12-02
R1 R4 R6 R90 = R0402_0R_JUMPER: Resistor; Part Description: 1A (0.05R Max DC Resistance) Zero Ohm Jumper; Manufacturer: GENERIC; Manufacturer1 Part Number: 232270591001L; Part Number: R0402_0R_JUMPER; Component Kind: Standard; Component Type: Standard; Pin Count: 2; Value: 0; Status: Not recommended; Manufacturer Part Number: R0402_0R_JUMPER; Case: 0402; Mounted: Yes; Sense: No; Socket: No; SMD: Yes; Manufacturer1 Example: YAGEO PHYCOMP; Manufacturer1 ComponentHeight: 0.4mm; HelpURL: \\cern.ch\dfs\Applications\Altium\Datasheets\R0402_Phycomp_RC0402.pdf; Author: CERN DEM JLC; CreateDate: 03.12.2007; LatestRevisionDate: 17.10.2012
R5 R55 = R0402_100R_1%_0.1W_100PPM: Resistor - 1%; Part Description: General Purpose Thick Film Chip Resistor; Manufacturer: GENERIC; Manufacturer Part Number: R0402_100R_1%_0.1W_100PPM_50V; Manufacturer1 Part Number: ERJ2RKF1000X; Power: 0.1W; TC: ±100ppm/°C; Voltage: 50V; Part Number: R0402_100R_1%_0.1W_100PPM; Component Kind: Standard; Component Type: Standard; Pin Count: 2; Value: 100; Status: Not recommended; Tolerance: ±1%; Case: 0402; Mounted: Yes; Sense: No; Socket: No; SMD: Yes; Manufacturer1 Example: PANASONIC; Manufacturer1 ComponentHeight: 0.4mm; HelpURL: \\cern.ch\dfs\Applications\Altium\Datasheets\R0402_PANASONIC_ERJ2RK.pdf; Author: CERN DEM JLC; CreateDate: 12.12.2013; LatestRevisionDate: 03.03.2015
R7 = R0603_24K_1%_0.1W_100PPM: Resistor - 1%; Part Description: General Purpose Thick Film Chip Resistor; Manufacturer: GENERIC; Manufacturer1 Part Number: NRC06F2402TRF; Power: 0.1W; TC: ±100ppm/°C; PressFit: No; Part Number: R0603_24K_1%_0.1W_100PPM; Component Kind: Standard; Component Type: Standard; Pin Count: 2; Value: 24k; Status: Preferred; Tolerance: ±1%; Manufacturer Part Number: R0603_24K_1%_0.1W_100PPM; Case: 0603; Mounted: Yes; Sense: No; Socket: No; SMD: Yes; Manufacturer1 Example: NIC COMPONENT; Manufacturer1 ComponentHeight: 0.55mm; HelpURL: \\cern.ch\dfs\Applications\Altium\Datasheets\R0603_NIC_NRC.pdf; Author: CERN DEM JLC; CreateDate: 03.12.2007; LatestRevisionDate: 13.03.2008
RN1 RN2 = RN_10K_5K_VISHAY_AORN2-1AT3: DIL8 Resistor Network 4 Resistors 10k-5k-5k-10k 0.1%; Part Description: Dual-In-Line Thin Film Precision Automotive Resistors Network, (4 Isolated) - AORN Series; Manufacturer: VISHAY DALE; Power: 4x0.1W; TC: ±25ppm/°C; PressFit: No; Part Number: RN_10K_5K_VISHAY_AORN2-1AT3; Component Kind: Standard; Component Type: Standard; Pin Count: 8; Value: 10k 5K 5K 10K; Sense: No; Tolerance: 0.1%; Manufacturer Part Number: AORN2-1AT3; Case: SOIC8; Mounted: Yes; Socket: No; SMD: Yes; ComponentHeight: 1.73mm; HelpURL: \\cern.ch\dfs\Applications\Altium\Datasheets\RN_VISHAY_AORN.pdf; Author: CERN DEM JLC; CreateDate: 20.02.2017; LatestRevisionDate: 20.02.2017

## Sheet Input_channel.SchDoc: Phaser
size 420 x 297 mm; EDA_Number: ARTIQ; Projet: Sampler; Author: G.Kasprowicz; CompanyName: WUT ISE; DrawnBy: G.Kasprowicz; Organization: WUT ISE; Address1: PW ISE; Address2: Nowowiejska 15/19 00-665 Warsaw; Address3: gkasprow@gmail.com; Revision: 2; SheetNumber: -; SheetTotal: -; ModifiedBy: -; CheckedDate: -; Title2: xxx; DivGrp: WUT ISE; Designer: G.Kasprowicz; ModifiedDate: -; ProjectName: Sensor Box
Used 2 times, as channels U_Input_channel, U_Input_channel. Parts and nets are listed once, with the designators drawn on the sheet.
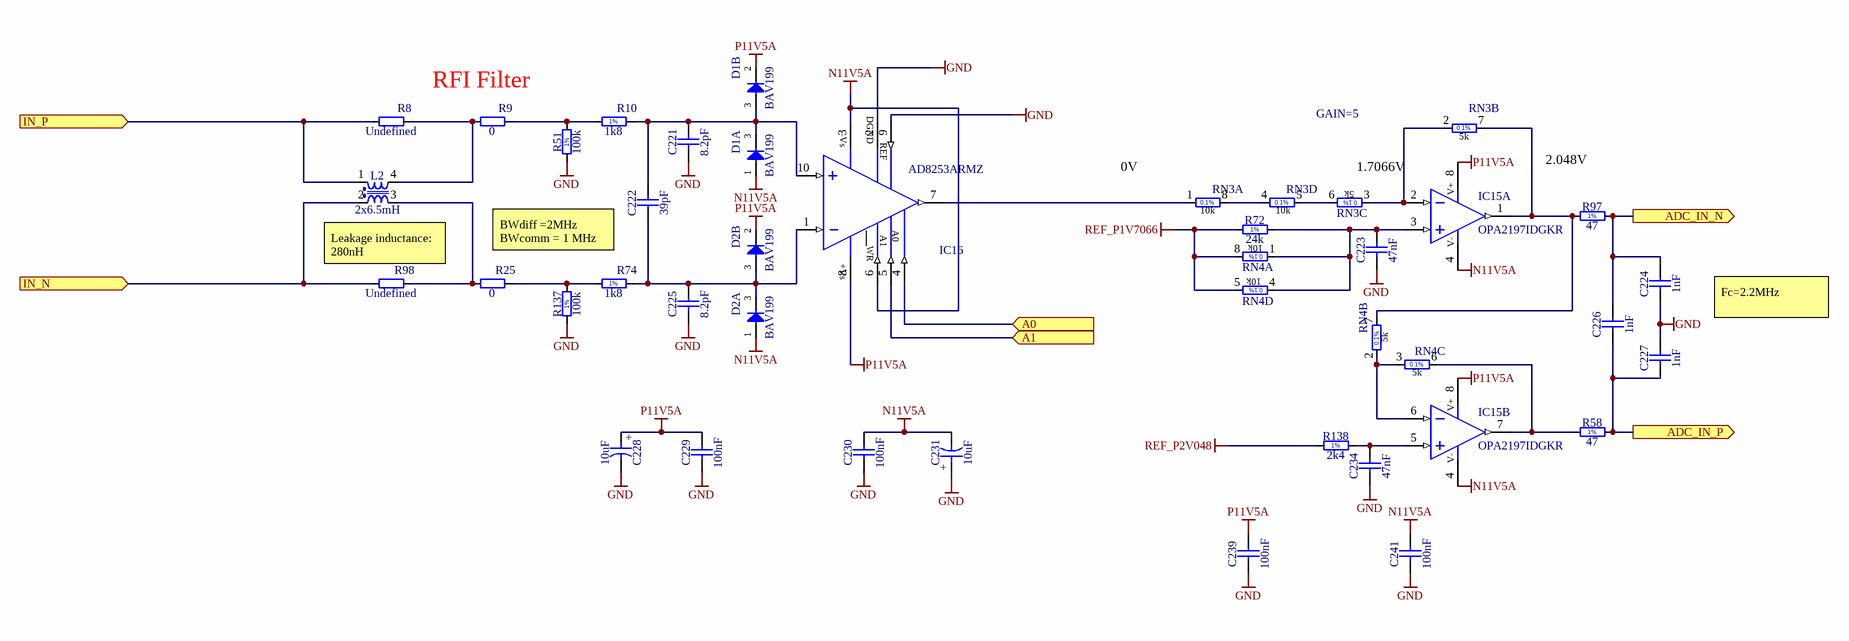
[diagram p5: Input_channel.SchDoc]

### Parts
C221  8.2pF  [CAPC1608X87N]
C222  39pF  [CAPC1608X87N]
C223  47nF  [CAPC2012X135N]
C224  1nF  [CAPC1608X90N]
C225  8.2pF  [CAPC1608X87N]
C226  1nF  [CAPC1608X90N]
C227  1nF  [CAPC1608X90N]
C228  10uF  [CAPMP3216X180N]
C229  100nF  [CAPC1005X55N]
C230  100nF  [CAPC1005X55N]
C231  10uF  [CAPMP3216X180N]
C234  47nF  [CAPC2012X135N]
C239  100nF  [CAPC1005X55N]
C241  100nF  [CAPC1005X55N]
D1  BAV199  [SOT95P240X110-3N]  (parts A,B of 2)
D2  BAV199  [SOT95P240X110-3N]  (parts A,B of 2)
IC15  OPA2197IDGKR  [SOP65P490X110-8N]  (parts A,B of 2)
IC16  AD8253ARMZ  [SOP50P490X110-10N]
L2  2x6.5mH  [IND_WURTH_WE-SL2]
R8  Undefined  [RESC1608X55N]
R9  0  [RESC1608X55N]
R10  1k8  [RESC1608X55N]
R25  0  [RESC1608X55N]
R51  100k  [RESC1608X55N]
R58  47  [RESC1005X40N]
R72  24k  [RESC1608X55N]
R74  1k8  [RESC1608X55N]
R97  47  [RESC1005X40N]
R98  Undefined  [RESC1608X55N]
R137  100k  [RESC1608X55N]
R138  2k4  [RESC1005X40N]
RN3  10k 5K 5K 10K  [SOIC127P600X175-8N]  (value not drawn)  (parts A,B,C,D of 4)
RN4  10k 5K 5K 10K  [SOIC127P600X175-8N]  (value not drawn)  (parts A,B,C,D of 4)

### Ports
A0 (in), A1 (in), ADC_IN_N (out), ADC_IN_P (out), IN_N (in), IN_P (in)

### Nets
GND: C221.1 C223.1 C224.1 C225.1 C227.2 C228.2 C229.1 C230.1 C231.1 C234.1 C239.1 C241.1 IC16.2(DGND) IC16.9(REF) R51.1 R137.1
N11V5A: C230.2 C231.2 C241.2 D1.1(A) D2.1(A) IC15.4(V-) IC16.3(-VS) IC16.6(~{WR})
P11V5A: C228.1 C229.2 C239.2 D1.2(C) D2.2(C) IC15.8(V+) IC16.8(+VS)
REF_P1V7066: R72.1 RN4.5 RN4.8
REF_P2V048: R138.1
A0: IC16.4(A0) ; port A0
A1: IC16.5(A1) ; port A1
ADC_IN_N: C224.2 C226.2 R97.2 ; port ADC_IN_N
ADC_IN_P: C226.1 C227.1 R58.2 ; port ADC_IN_P
IN_N: L2.2 R98.1 ; port IN_N
IN_P: L2.1 R8.1 ; port IN_P
NetC221_2: C221.2 C222.2 D1.3(COMAC) IC16.10(+IN) R10.2
NetC222_1: C222.1 C225.2 D2.3(COMAC) IC16.1(-IN) R74.2
NetC223_2: C223.2 IC15.3(IN+) R72.2 RN4.1 RN4.4
NetC234_2: C234.2 IC15.5(IN+) R138.2
NetIC15_1: IC15.1(OUT) R97.1 RN3.7 RN4.7
NetIC15_2: IC15.2(IN-) RN3.2 RN3.3
NetIC15_6: IC15.6(IN-) RN4.2 RN4.3
NetIC15_7: IC15.7(OUT) R58.1 RN4.6
NetIC16_7: IC16.7(OUT) RN3.1
NetL2_3: L2.3 R25.1 R98.2
NetL2_4: L2.4 R8.2 R9.1
NetR9_2: R9.2 R10.1 R51.2
NetR25_2: R25.2 R74.1 R137.2
NetRN3_4: RN3.4 RN3.8
NetRN3_5: RN3.5 RN3.6

### Channels
U_Input_channel: designators end in A; ports A0=CH0_GAIN_A0 A1=CH0_GAIN_A1 ADC_IN_N=IN_0_N ADC_IN_P=IN_0_P IN_N=SG1 IN_P=NetJ3_1
U_Input_channel: designators end in B; ports A0=CH1_GAIN_A0 A1=CH1_GAIN_A1 ADC_IN_N=IN_1_N ADC_IN_P=IN_1_P IN_N=SG2 IN_P=NetJ4_1

### Notes on the sheet
- RFI Filter
- GAIN=5
- 0V
- 1.7066V
- 2.048V
- Leakage inductance: 280nH
- BWdiff =2MHz
  BWcomm = 1 MHz
- Fc=2.2MHz
- Project/Equipment
- Document
- Designer
- Drawn by
- Check.by
- Copyright WUT ISE 2018.
  This documentation describes Open Hardware and is licensed under the CERN OHL v.1.1. You may redistribute and modify this documentation under the terms of the CERN OHL v.1.1. (http://ohwr.org/CERNOHL). This documentation is distributed WITHOUT ANY EXPRESS OR IMPLIED WARRANTY, INCLUDING OF MERCHANTABILITY, SATISFACTORY QUALITY AND FITNESS FOR A PARTICULAR PURPOSE. Please see the CERN OHL v.1.1 for applicable conditions.
- Contact
- File
- Last Mod.
- Print Date
- Sheet
- Size
- A3
- of
- Rev
- (in symbol AD8253ARMZ) -Vs; WR; +Vs
- (in symbol CTE3216-18_10UF_16V_20%_AVX_TCJ) +
- (in symbol R0402_2K4_1%_0.0625W_100PPM) 1%
- (in symbol R0402_47R_1%_0.0625W_100PPM) 1%
- (in symbol R0603_1K8_1%_0.1W_100PPM) 1%
- (in symbol R0603_24K_1%_0.1W_100PPM) 1%
- (in symbol R0603_100K_1%_0.1W_100PPM) 1%
- (in symbol RN_10K_5K_VISHAY_AORN2-1AT3, part A) 10k
- (in symbol RN_10K_5K_VISHAY_AORN2-1AT3, part B) 5k
- (in symbol RN_10K_5K_VISHAY_AORN2-1AT3, part C) 5k
- (in symbol RN_10K_5K_VISHAY_AORN2-1AT3, part D) 10k

### Library data of the parts
C221 C225 = CC0603_8.2PF_50V_0.5PF_NP0: Non-polarised capacitor; Part Description: SMD Multilayer Chip Ceramic Capacitor; Manufacturer: GENERIC; Manufacturer1 Part Number: 223886715828; Voltage: 50V; TC: C0G/NP0; Tolerance: ±0.5pF; Part Number: CC0603_8.2PF_50V_0.5PF_NP0; Component Kind: Standard; Component Type: Standard; Pin Count: 2; Value: 8.2pF; Status: Preferred; Manufacturer Part Number: CC0603_8.2PF_50V_0.5PF_NP0; Case: 0603; Mounted: Yes; Socket: No; SMD: Yes; Sense: No; Manufacturer1 Example: PHYCOMP; Manufacturer1 ComponentHeight: 0.87mm; HelpURL: \\cern.ch\dfs\Applications\Altium\Datasheets\CC0603_NP0_PHYCOMP.pdf; Author: CERN DEM JLC; CreateDate: 03.12.2007; LatestRevisionDate: 03.12.2007
C222 = CC0603_39PF_50V_5%_NP0: Non-polarised capacitor; Part Description: SMD Multilayer Chip Ceramic Capacitor; Manufacturer: GENERIC; Manufacturer1 Part Number: 223886715399; Voltage: 50V; TC: C0G/NP0; Tolerance: ±5%; Part Number: CC0603_39PF_50V_5%_NP0; Component Kind: Standard; Component Type: Standard; Pin Count: 2; Value: 39pF; Status: Preferred; Manufacturer Part Number: CC0603_39PF_50V_5%_NP0; Case: 0603; Mounted: Yes; Socket: No; SMD: Yes; Sense: No; HelpURL: \\cern.ch\dfs\Applications\Altium\Datasheets\CC0603_NP0_PHYCOMP.pdf; Author: CERN DEM JLC; CreateDate: 03.12.2007; LatestRevisionDate: 03.12.2007; Manufacturer1 Example: PHYCOMP; Manufacturer1 ComponentHeight: 0.87mm
C223 C234 = CC0805_47NF_25V_5%_C0G: as C86 on sheet ADC_2CH; Part Number: CC0805_47NF_25V_5%_C0G; Component Kind: Standard; Component Type: Standard; Pin Count: 2; Value: 47nF; Status: None; Manufacturer Part Number: CC0805_47NF_25V_5%_C0G; Case: 0805; Mounted: Yes; Socket: No; SMD: Yes; Sense: No; Manufacturer1 Example: KEMET; Manufacturer1 ComponentHeight: 1.4mm; HelpURL: \\cern.ch\dfs\Applications\Altium\Datasheets\CC0805_C0G_KEMET_(Commercial Grade).pdf; Author: CERN DEM JLC; CreateDate: 18.01.2011; LatestRevisionDate: 18.01.2011
C224 C226 C227 = CC0603_1NF_50V_1%_NP0: Non-polarised capacitor; Part Description: SMD Multilayer Chip Ceramic Capacitor; Manufacturer: GENERIC; Manufacturer1 Part Number: 06035A102FAT2A; Voltage: 50V; TC: C0G/NP0; Tolerance: ±1%; Part Number: CC0603_1NF_50V_1%_NP0; Component Kind: Standard; Component Type: Standard; Pin Count: 2; Value: 1nF; Status: None; Manufacturer Part Number: CC0603_1NF_50V_1%_NP0; Case: 0603; Mounted: Yes; Socket: No; SMD: Yes; Sense: No; Manufacturer1 Example: AVX; Manufacturer1 ComponentHeight: 0.9mm; HelpURL: \\cern.ch\dfs\Applications\Altium\Datasheets\CC0603_C0G_AVX.pdf; Author: CERN DEM JLC; CreateDate: 15.06.2017; LatestRevisionDate: 15.06.2017
C228 C231 = CTE3216-18_10UF_16V_20%_AVX_TCJ: as C246 on sheet PWR_Supply; Part Number: CTE3216-18_10UF_16V_20%_AVX_TCJ; Component Kind: Standard; Component Type: Standard; Pin Count: 2; Value: 10uF; Status: Preferred; Case: A; Mounted: Yes; Socket: No; SMD: Yes; Sense: No; ComponentHeight: 1.8mm; HelpURL: \\cern.ch\dfs\Applications\Altium\Datasheets\CTE_AVX_TCJ.pdf; Author: CERN DEM JLC; CreateDate: 29.03.2012; LatestRevisionDate: 29.03.2012
C229 C230 C239 C241 = CC0402_100NF_16V_10%_X7R: Non-polarised capacitor; Part Description: SMD Multilayer Chip Ceramic Capacitor; Manufacturer: GENERIC; Manufacturer1 Part Number: GRM155R71C104KA88D; Voltage: 16V; TC: X7R; Tolerance: ±10%; Part Number: CC0402_100NF_16V_10%_X7R; Component Kind: Standard; Component Type: Standard; Pin Count: 2; Value: 100nF; Status: Not Recommended; Manufacturer Part Number: CC0402_100NF_16V_10%_X7R; Case: 0402; Mounted: Yes; Socket: No; SMD: Yes; Sense: No; Manufacturer1 Example: MURATA; Manufacturer1 ComponentHeight: 0.55mm; HelpURL: \\cern.ch\dfs\Applications\Altium\Datasheets\CC0402_X7R_MURATA_GRM.pdf; Author: CERN DEM JLC; CreateDate: 2013-12-05; LatestRevisionDate: 2007-12-03
D1 D2 = BAV199: Serial Diode; Part Description: Low-Leakage Double Diode; Manufacturer: NXP SEMICONDUCTORS; Voltage: 75V; Power: 250mW; PressFit: No; Bonding: No; Part Number: BAV199; Component Kind: Standard; Component Type: Standard; Device: BAV199; PackageDescription: SOT23 3-Leads, Pitch 0.95mm - Body 1.4x3mm, IPC Medium Density; Manufacturer Part Number: BAV199; Pin Count: 3; Case: SOT23-3; Mounted: Yes; Socket: No; SMD: Yes; Sense: No; ComponentHeight: 1.1mm; HelpURL: \\cern.ch\dfs\Applications\Altium\Datasheets\BAV199.pdf; Author: CERN DEM JMW; CreateDate: 2008-11-21; LatestRevisionDate: 2008-11-21
IC15 = OA_OPA2197IDGKR: as IC12 on sheet ADC_2CH; Part Number: OPA2197IDGKR; Component Kind: Standard; Component Type: Standard; Device: OPA2197IDGKR; PackageDescription: SOP, 0.65mm pitch; 8 pin, 3.00mm W X 3.00mm L X 1.10mm H body, IPC Medium Density; Manufacturer Part Number: OPA2197IDGKR; Pin Count: 8; Case: MSOP8; Mounted: Yes; Socket: No; SMD: Yes; Sense: No; ComponentHeight: 1.1mm; Author: GK; HelpURL: \\cern.ch\dfs\Applications\Altium\Datasheets\OPA2140AIDGK.pdf; CreateDate: 20.04.2017; LatestRevisionDate: 20.04.2017
IC16 = AD8253ARMZ: 10MHz, 20V/us, G= 1, 10, 100, 1000 iCMOS Programmable Gain Instrumentation Amplifier; Manufacturer: ANALOG DEVICES; PressFit: No; Bonding: No; Part Number: AD8253ARMZ; Component Kind: Standard; Component Type: Standard; Device: AD8253ARMZ; PackageDescription: MSOP, 10-Leads, Body 3.1x3.1mm (max), Pitch 0.50mm, IPC Medium Density; Part Description: 10MHz, 20V/us, G= 1, 10, 100, 1000 iCMOS Programmable Gain Instrumentation Amplifier; Manufacturer Part Number: AD8253ARMZ; Pin Count: 8; Case: MSOP10; Mounted: Yes; Socket: No; SMD: Yes; Sense: No; ComponentHeight: 1.1mm; Author: CERN DEM JLC; HelpURL: \\cern.ch\dfs\Applications\Altium\Datasheets\AD8253ARMZ.pdf; CreateDate: 2013-10-02; LatestRevisionDate: 2013-10-02
L2 = IND_6.5MH_50%_WURTH_WE-SL2-744229: Inductor Common Mode; Part Description: Common Mode SMD Line Filter (WE-SL2 Serie); Manufacturer: WURTH ELEKTRONIK; Manufacturer Part Number: 744229; Power: 400mA; Resistance: 0.95R; Tolerance: ±50%; Part Number: IND_6.5MH_50%_WURTH_WE-SL2-744229; Component Kind: Standard; Component Type: Standard; Pin Count: 4; Value: 2x6.5mH; Status: None; Mounted: Yes; Socket: No; SMD: Yes; Sense: No; ComponentHeight: 5.3mm; HelpURL: \\cern.ch\dfs\Applications\Altium\Datasheets\IND_WURTH_WE-SL2_744229.pdf; Author: CERN DEM JLC; CreateDate: 01.10.2012; LatestRevisionDate: 15.10.2012
R8 R98 = R0603_NO-VALUE: Resistor; Part Description: Reserved Footprint For a 0603 (1608) Chip Resistor; Mounted: No; Part Number: R0603_NO-VALUE; Component Kind: Standard; Component Type: Standard; Pin Count: 2; Value: Undefined; Status: None; Manufacturer: Undefined; Manufacturer Part Number: R0603_NO-VALUE; Case: 0603; Sense: No; Socket: No; SMD: Yes; Manufacturer1 Example: Undefined; Manufacturer1 Part Number: Undefined; Manufacturer1 ComponentHeight: Undefined; HelpURL: Undefined; Author: CERN DEM JLC; CreateDate: 03.12.2007; LatestRevisionDate: 13.03.2008
R9 R25 = R0603_0R_JUMPER: Resistor; Part Description: 1A (0.05R Max DC Resistance) Zero Ohm Jumper; Manufacturer: GENERIC; Manufacturer1 Part Number: NRC06Z0; Part Number: R0603_0R_JUMPER; Component Kind: Standard; Component Type: Standard; Pin Count: 2; Value: 0; Status: Preferred; Manufacturer Part Number: R0603_0R_JUMPER; Case: 0603; Mounted: Yes; Sense: No; Socket: No; SMD: Yes; Manufacturer1 Example: NIC COMPONENT; Manufacturer1 ComponentHeight: 0.55mm; HelpURL: \\cern.ch\dfs\Applications\Altium\Datasheets\R0603_NIC_NRC.pdf; Author: CERN DEM JLC; CreateDate: 03.12.2007; LatestRevisionDate: 13.03.2008
R10 R74 = R0603_1K8_1%_0.1W_100PPM: Resistor - 1%; Part Description: General Purpose Thick Film Chip Resistor; Manufacturer: GENERIC; Manufacturer1 Part Number: NRC06F1801TRF; Power: 0.1W; TC: ±100ppm/°C; Part Number: R0603_1K8_1%_0.1W_100PPM; Component Kind: Standard; Component Type: Standard; Pin Count: 2; Value: 1k8; Status: Preferred; Tolerance: ±1%; Manufacturer Part Number: R0603_1K8_1%_0.1W_100PPM; Case: 0603; Mounted: Yes; Sense: No; Socket: No; SMD: Yes; Manufacturer1 Example: NIC COMPONENT; Manufacturer1 ComponentHeight: 0.55mm; HelpURL: \\cern.ch\dfs\Applications\Altium\Datasheets\R0603_NIC_NRC.pdf; Author: CERN DEM JLC; CreateDate: 03.12.2007; LatestRevisionDate: 13.03.2008
R51 R137 = R0603_100K_1%_0.1W_100PPM: Resistor - 1%; Part Description: General Purpose Thick Film Chip Resistor; Manufacturer: GENERIC; Manufacturer1 Part Number: NRC06F1003TRF; Power: 0.1W; TC: ±100ppm/°C; Part Number: R0603_100K_1%_0.1W_100PPM; Component Kind: Standard; Component Type: Standard; Pin Count: 2; Value: 100k; Status: Preferred; Tolerance: ±1%; Manufacturer Part Number: R0603_100K_1%_0.1W_100PPM; Case: 0603; Mounted: Yes; Sense: No; Socket: No; SMD: Yes; Manufacturer1 Example: NIC COMPONENT; Manufacturer1 ComponentHeight: 0.55mm; HelpURL: \\cern.ch\dfs\Applications\Altium\Datasheets\R0603_NIC_NRC.pdf; Author: CERN DEM JLC; CreateDate: 03.12.2007; LatestRevisionDate: 13.03.2008
R58 R97 = R0402_47R_1%_0.0625W_100PPM: Resistor - 1%; Part Description: General Purpose Thick Film Chip Resistor; Manufacturer: GENERIC; Manufacturer1 Part Number: 232270674709L; TC: ±100ppm/°C; PressFit: No; Part Number: R0402_47R_1%_0.0625W_100PPM; Component Kind: Standard; Component Type: Standard; Pin Count: 2; Value: 47; Status: Not Recommended; Power: 0.0625W; Tolerance: ±1%; Manufacturer Part Number: R0402_47R_1%_0.0625W_100PPM; Case: 0402; Mounted: Yes; Sense: No; Socket: No; SMD: Yes; Manufacturer1 Example: YAGEO PHYCOMP; Manufacturer1 ComponentHeight: 0.4mm; HelpURL: \\cern.ch\dfs\Applications\Altium\Datasheets\R0402_Phycomp_RC0402.pdf; Author: CERN DEM JLC; CreateDate: 03.12.2007; LatestRevisionDate: 17.10.2012
R72 = R0603_24K_1%_0.1W_100PPM: as R7 on sheet ADC_2CH; Part Number: R0603_24K_1%_0.1W_100PPM; Component Kind: Standard; Component Type: Standard; Pin Count: 2; Value: 24k; Status: Preferred; Tolerance: ±1%; Manufacturer Part Number: R0603_24K_1%_0.1W_100PPM; Case: 0603; Mounted: Yes; Sense: No; Socket: No; SMD: Yes; Manufacturer1 Example: NIC COMPONENT; Manufacturer1 ComponentHeight: 0.55mm; HelpURL: \\cern.ch\dfs\Applications\Altium\Datasheets\R0603_NIC_NRC.pdf; Author: CERN DEM JLC; CreateDate: 03.12.2007; LatestRevisionDate: 13.03.2008
R138 = R0402_2K4_1%_0.0625W_100PPM: Resistor - 1%; Part Description: General Purpose Thick Film Chip Resistor; Manufacturer: GENERIC; Manufacturer1 Part Number: 232270672402L; TC: ±100ppm/°C; PressFit: No; Part Number: R0402_2K4_1%_0.0625W_100PPM; Component Kind: Standard; Component Type: Standard; Pin Count: 2; Value: 2k4; Status: Not Recommended; Power: 0.0625W; Tolerance: ±1%; Manufacturer Part Number: R0402_2K4_1%_0.0625W_100PPM; Case: 0402; Mounted: Yes; Sense: No; Socket: No; SMD: Yes; Manufacturer1 Example: YAGEO PHYCOMP; Manufacturer1 ComponentHeight: 0.4mm; HelpURL: \\cern.ch\dfs\Applications\Altium\Datasheets\R0402_Phycomp_RC0402.pdf; Author: CERN DEM JLC; CreateDate: 03.12.2007; LatestRevisionDate: 17.10.2012
RN3 RN4 = RN_10K_5K_VISHAY_AORN2-1AT3: as RN1 on sheet ADC_2CH; Part Number: RN_10K_5K_VISHAY_AORN2-1AT3; Component Kind: Standard; Component Type: Standard; Pin Count: 8; Value: 10k 5K 5K 10K; Sense: No; Tolerance: 0.1%; Manufacturer Part Number: AORN2-1AT3; Case: SOIC8; Mounted: Yes; Socket: No; SMD: Yes; ComponentHeight: 1.73mm; HelpURL: \\cern.ch\dfs\Applications\Altium\Datasheets\RN_VISHAY_AORN.pdf; Author: CERN DEM JLC; CreateDate: 20.02.2017; LatestRevisionDate: 20.02.2017